# Altium schematic sheet Camera.SchDoc
size A4; SheetNumber: 1; SheetTotal: 4
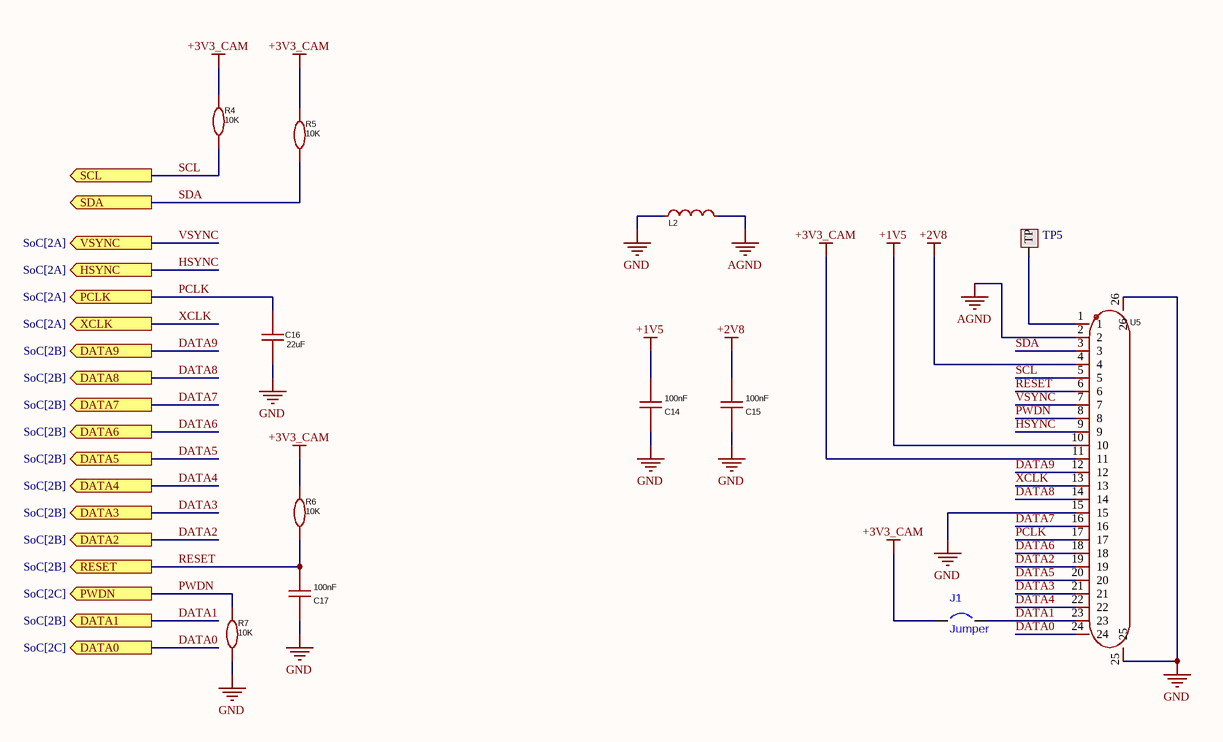
[diagram p0: Camera.SchDoc]

## Parts
C14  100nF  [100nF SMD Ceramic 201]
C15  100nF  [100nF SMD Ceramic 201]
C16  22uF  [22uF SMD Ceramic 1210]
C17  100nF  [100nF SMD Ceramic 201]
J1  Jumper  [PAD-JUMPER-2]
L2  BLM15AG601SN1D  [Ferrite]  (value not drawn)
R4  10K  [10K SMD Ceramic 201]
R5  10K  [10K SMD Ceramic 201]
R6  10K  [10K SMD Ceramic 201]
R7  10K  [10K SMD Ceramic 201]
TP5  TEST POINT  [TESTPOINT]  (value not drawn)
U5  FPC-05FB-24PH20  [Camera Connector]  (value not drawn)

## Ports
DATA0 (out, see SoC[2C]), DATA1 (out, see SoC[2B]), DATA2 (out, see SoC[2B]), DATA3 (out, see SoC[2B]), DATA4 (out, see SoC[2B]), DATA5 (out, see SoC[2B]), DATA6 (out, see SoC[2B]), DATA7 (out, see SoC[2B]), DATA8 (out, see SoC[2B]), DATA9 (out, see SoC[2B]), HSYNC (out, see SoC[2A]), PCLK (out, see SoC[2A]), PWDN (out, see SoC[2C]), RESET (out, see SoC[2B]), SCL (out, see SoC[2A]), SDA (out, see SoC[2A]), VSYNC (out, see SoC[2A]), XCLK (out, see SoC[2A])

## Nets
+1V5: C14.2 U5.10
+2V8: C15.2 U5.4
+3V3_CAM: J1.1 R4.2 R5.2 R6.2 U5.11
AGND: L2.2 U5.2
GND: C14.1 C15.1 C16.1 C17.1 L2.1 R7.1 U5.15 U5.25 U5.26
DATA0: U5.24 ; port DATA0
DATA1: J1.2 U5.23 ; port DATA1
DATA2: U5.19 ; port DATA2
DATA3: U5.21 ; port DATA3
DATA4: U5.22 ; port DATA4
DATA5: U5.20 ; port DATA5
DATA6: U5.18 ; port DATA6
DATA7: U5.16 ; port DATA7
DATA8: U5.14 ; port DATA8
DATA9: U5.12 ; port DATA9
HSYNC: U5.9 ; port HSYNC
PCLK: C16.2 U5.17 ; port PCLK
PWDN: R7.2 U5.8 ; port PWDN
RESET: C17.2 R6.1 U5.6 ; port RESET
SCL: R4.1 U5.5 ; port SCL
SDA: R5.1 U5.3 ; port SDA
VSYNC: U5.7 ; port VSYNC
XCLK: U5.13 ; port XCLK
NetTP5_1: TP5.1(TP) U5.1

## Notes on the sheet
- Date:
- Rev. No.
- Page No.
- Schematic Name
- Designed By
- Omar Faruk Badhon
- Check(1) HW Eng.
- Check(2) SW Eng.
- Approval(1)
- Approval(2)
- Address
- Company
- Dept. Name
- R&D

## Library data of the parts
C14 C15 C17 = 100nF SMD Ceramic 201: 10V 100nF X5R ±10% 0201 Multilayer Ceramic Capacitors MLCC - SMD/SMT ROHS; Manufacturer: muRata(村田); Symbol: GRM033R61A104KE84D; Add into BOM: yes; Device: GRM033R61A104KE84D; LCSC Part Name: 100nF ±10% 10V; Supplier Part: C161466; Manufacturer Part: GRM033R61A104KE84D; Supplier Footprint: 0201; JLCPCB Part Class: Extended Part; Datasheet: https://atta.szlcsc.com/upload/public/pdf/source/20181011/C161466_67687620A192BB2B75972275444AF1E7.pdf; Supplier: LCSC; Convert to PCB: yes; Value: 100nF; Tolerance: ±10%
C16 = 22uF SMD Ceramic 1210: 10V 22uF X7R ±10% 1210 Multilayer Ceramic Capacitors MLCC - SMD/SMT ROHS; Manufacturer: KEMET(基美); Symbol: C1210C226K8RACAUTO; Add into BOM: yes; Device: C1210C226K8RACAUTO; LCSC Part Name: 22uF ±10% 10V; Supplier Part: C561843; Manufacturer Part: C1210C226K8RACAUTO; Supplier Footprint: 1210; JLCPCB Part Class: Extended Part; Datasheet: https://atta.szlcsc.com/upload/public/pdf/source/20200618/C561824_5D581F10239D32C68F7958F74E29471B.pdf; Supplier: LCSC; Convert to PCB: yes; Value: 22uF; Tolerance: ±10%
J1 = JUMPER SOLDER BRIDGE: SMD JUMPER
L2 = BLM15AG601SN1D: 520mΩ ±25% 600Ω@100MHz 0402 Ferrite Beads ROHS; Manufacturer: muRata(村田); Add into BOM: yes; Current Rating: 300mA; Circuits: 1; Symbol: BLM15AG601SN1D; Device: BLM15AG601SN1D; LCSC Part Name: 单路 0402磁珠 阻抗600Ω@100MHz; Supplier Part: C76884; Manufacturer Part: BLM15AG601SN1D; Supplier Footprint: 0402; JLCPCB Part Class: Extended Part; Datasheet: https://atta.szlcsc.com/upload/public/pdf/source/20181120/C333978_3E581FB55966932B05020139ABDE8E01.pdf; Supplier: LCSC; Convert to PCB: yes; Impedance @ Frequency: 600Ω@100MHz; Tolerance: ±25%; DC Resistance: 520mΩ
R4-R7 = 10K SMD Ceramic 201: 50mW Thick Film Resistors 25V ±1% ±200ppm/℃ 10kΩ 0201 Chip Resistor - Surface Mount ROHS; Manufacturer: YAGEO(国巨); Symbol: AF0201FR-0710KL; Add into BOM: yes; Device: AF0201FR-0710KL; LCSC Part Name: 厚膜电阻 10kΩ ±1% 50mW; Supplier Part: C143978; Manufacturer Part: AF0201FR-0710KL; Supplier Footprint: 0201; JLCPCB Part Class: Extended Part; Datasheet: https://atta.szlcsc.com/upload/public/pdf/source/20180927/C229861_4ABDC471507C1ED6AFB4BA66AFC8620A.pdf; Supplier: LCSC; Convert to PCB: yes; Type: Thick Film Resistors; Value: 10kΩ; Tolerance: ±1%; Temperature Coefficient: ±200ppm/℃; Operating Temperature Range: -55℃~+125℃
U5 = Camera Connector: Dual-sided contacts / top and bottom connection -25℃~+85℃ Flip type 0.5mm Horizontal attachment 24P SMD; Manufacturer: XUNPU(讯普); Add into BOM: yes; Locking Feature: Clamshell; FFC, FCB Thickness: 0.3mm; Symbol: FPC-05FB-24PH20; Device: FPC-05FB-24PH20; LCSC Part Name: 间距:0.5mm P数:24P 翻盖式 双侧触点/上下接; Supplier Part: C2856831; Manufacturer Part: FPC-05FB-24PH20; Supplier Footprint: SMD,P=0.5mm,卧贴; JLCPCB Part Class: Extended Part; Datasheet: https://atta.szlcsc.com/upload/public/pdf/source/20210922/C2856831_717985F95873A81D5C0B7E3F2E5E5327.pdf; Supplier: LCSC; Convert to PCB: yes; Contact Type: Double-sided contacts/up and down connection; Number of Contacts: 24P; Pitch: 0.5mm; Mounting Type: 卧贴; Height Above Board: 2mm; Operating Temperature Range: -25℃~+85℃